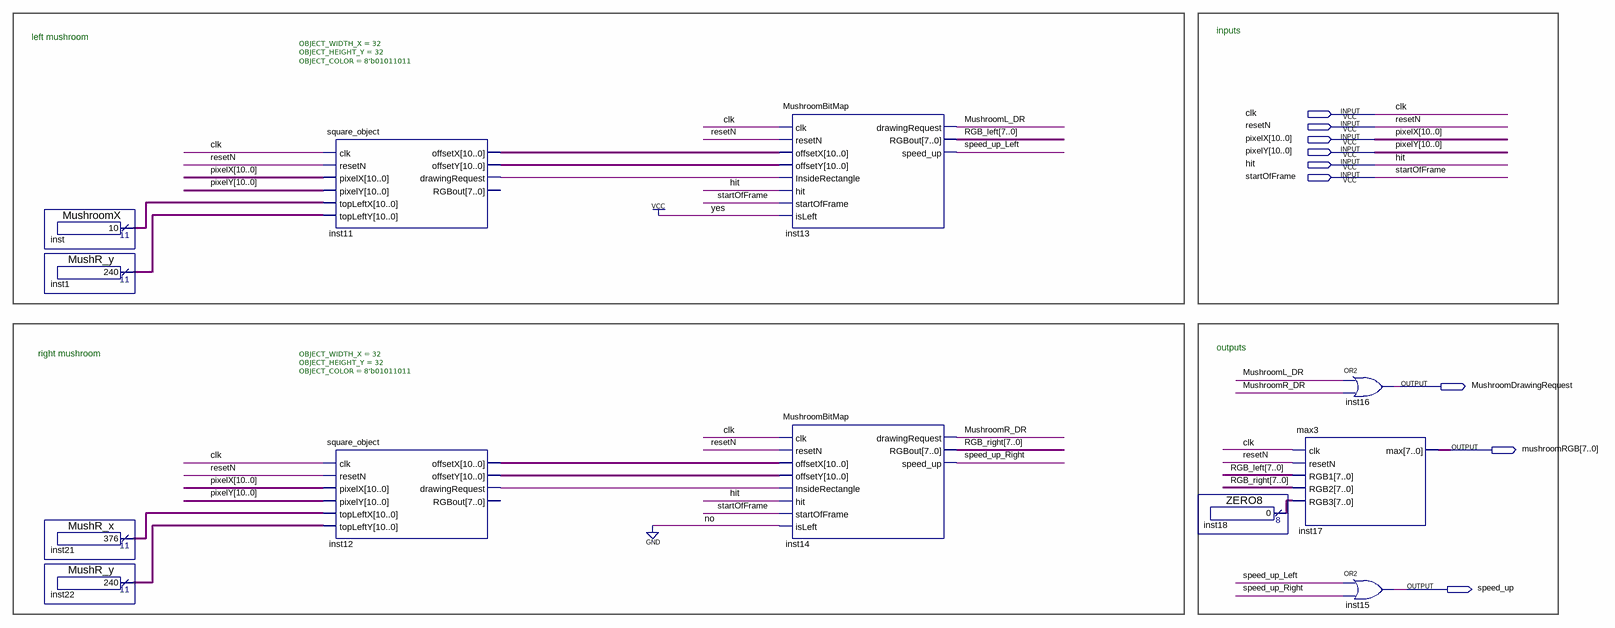
[diagram p0: schematic sheet]
// Quartus schematic MUSHROOM_DISPLAY.bdf as structural Verilog: 12 symbols, 9 pins
module MUSHROOM_DISPLAY (
  input  clk,
  input  resetN,
  input  [10:0] pixelX,
  input  [10:0] pixelY,
  input  hit,
  input  startOfFrame,
  output MushroomDrawingRequest,
  output [7:0] mushroomRGB,
  output speed_up
);

  wire inst11_drawingrequest, inst12_drawingrequest, MushroomL_DR, MushroomR_DR, speed_up_Left,
       speed_up_Right;
  wire [7:0] inst18_result, RGB_left, RGB_right;
  wire [10:0] inst1_result, inst11_offsetx, inst11_offsety, inst12_offsetx, inst12_offsety, inst21_result,
       inst22_result, inst_result;

  MushroomX inst (.result(inst_result));
  MushR_y inst1 (.result(inst1_result));
  MushR_x inst21 (.result(inst21_result));
  MushR_y inst22 (.result(inst22_result));
  square_object #(.OBJECT_WIDTH_X(32), .OBJECT_HEIGHT_Y(32), .OBJECT_COLOR(8'b01011011)) inst11 (
    .clk(clk), .resetN(resetN), .pixelX(pixelX), .pixelY(pixelY), .topLeftX(inst_result),
    .topLeftY(inst1_result), .offsetX(inst11_offsetx), .offsetY(inst11_offsety),
    .drawingRequest(inst11_drawingrequest));  // open: RGBout
  square_object #(.OBJECT_WIDTH_X(32), .OBJECT_HEIGHT_Y(32), .OBJECT_COLOR(8'b01011011)) inst12 (
    .clk(clk), .resetN(resetN), .pixelX(pixelX), .pixelY(pixelY), .topLeftX(inst21_result),
    .topLeftY(inst22_result), .offsetX(inst12_offsetx), .offsetY(inst12_offsety),
    .drawingRequest(inst12_drawingrequest));  // open: RGBout
  MushroomBitMap inst13 (
    .clk(clk), .resetN(resetN), .offsetX(inst11_offsetx), .offsetY(inst11_offsety),
    .InsideRectangle(inst11_drawingrequest), .hit(hit), .startOfFrame(startOfFrame), .isLeft(1'b1),
    .drawingRequest(MushroomL_DR), .RGBout(RGB_left), .speed_up(speed_up_Left));
  MushroomBitMap inst14 (
    .clk(clk), .resetN(resetN), .offsetX(inst12_offsetx), .offsetY(inst12_offsety),
    .InsideRectangle(inst12_drawingrequest), .hit(hit), .startOfFrame(startOfFrame), .isLeft(1'b0),
    .drawingRequest(MushroomR_DR), .RGBout(RGB_right), .speed_up(speed_up_Right));
  ZERO8 inst18 (.result(inst18_result));
  max3 inst17 (.clk(clk), .resetN(resetN), .RGB1(RGB_left), .RGB2(RGB_right), .RGB3(inst18_result), .max(mushroomRGB));
  or inst16 (MushroomDrawingRequest, MushroomL_DR, MushroomR_DR);
  or inst15 (speed_up, speed_up_Left, speed_up_Right);

  // Notes on the sheet:
  //   inputs
  //   left mushroom
  //   outputs
  //   right mushroom
endmodule
